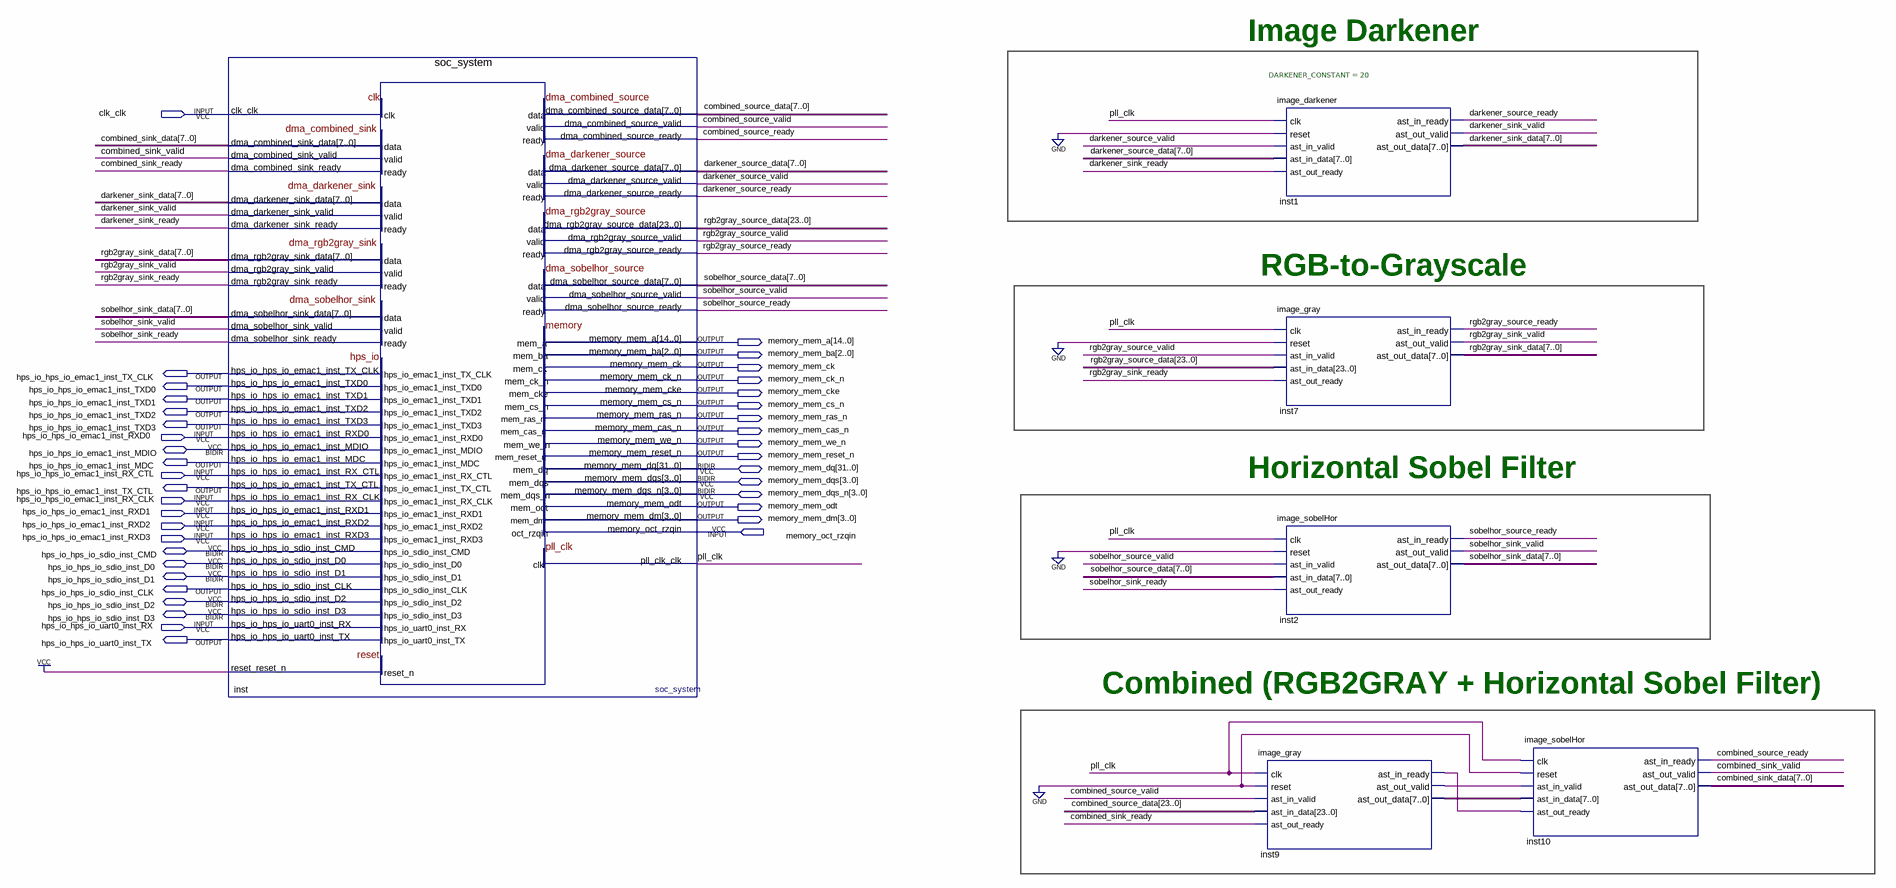
[diagram p0: schematic sheet]
// Quartus schematic main.bdf as structural Verilog: 6 symbols, 39 pins
module main (
  input  clk_clk,
  input  hps_io_hps_io_emac1_inst_RXD0,
  input  hps_io_hps_io_emac1_inst_RX_CTL,
  input  hps_io_hps_io_emac1_inst_RX_CLK,
  input  hps_io_hps_io_emac1_inst_RXD1,
  input  hps_io_hps_io_emac1_inst_RXD2,
  input  memory_oct_rzqin,
  input  hps_io_hps_io_emac1_inst_RXD3,
  input  hps_io_hps_io_uart0_inst_RX,
  inout  hps_io_hps_io_emac1_inst_MDIO,
  inout  [31:0] memory_mem_dq,
  inout  [3:0] memory_mem_dqs,
  inout  [3:0] memory_mem_dqs_n,
  inout  hps_io_hps_io_sdio_inst_CMD,
  inout  hps_io_hps_io_sdio_inst_D0,
  inout  hps_io_hps_io_sdio_inst_D1,
  inout  hps_io_hps_io_sdio_inst_D2,
  inout  hps_io_hps_io_sdio_inst_D3,
  output [14:0] memory_mem_a,
  output [2:0] memory_mem_ba,
  output memory_mem_ck,
  output hps_io_hps_io_emac1_inst_TX_CLK,
  output memory_mem_ck_n,
  output hps_io_hps_io_emac1_inst_TXD0,
  output memory_mem_cke,
  output hps_io_hps_io_emac1_inst_TXD1,
  output memory_mem_cs_n,
  output hps_io_hps_io_emac1_inst_TXD2,
  output memory_mem_ras_n,
  output hps_io_hps_io_emac1_inst_TXD3,
  output memory_mem_cas_n,
  output memory_mem_we_n,
  output memory_mem_reset_n,
  output hps_io_hps_io_emac1_inst_MDC,
  output hps_io_hps_io_emac1_inst_TX_CTL,
  output memory_mem_odt,
  output [3:0] memory_mem_dm,
  output hps_io_hps_io_sdio_inst_CLK,
  output hps_io_hps_io_uart0_inst_TX
);

  wire combined_sink_ready, combined_sink_valid, combined_source_ready, combined_source_valid,
       darkener_sink_ready, darkener_sink_valid, darkener_source_ready, darkener_source_valid,
       inst9_ast_in_ready, inst9_ast_out_valid, pll_clk, rgb2gray_sink_ready, rgb2gray_sink_valid,
       rgb2gray_source_ready, rgb2gray_source_valid, sobelhor_sink_ready, sobelhor_sink_valid,
       sobelhor_source_ready, sobelhor_source_valid;
  wire [7:0] combined_sink_data, darkener_sink_data, darkener_source_data, inst9_ast_out_data,
       rgb2gray_sink_data, sobelhor_sink_data, sobelhor_source_data;
  wire [23:0] combined_source_data, rgb2gray_source_data;

  soc_system inst (
    .clk_clk(clk_clk), .dma_combined_sink_data(combined_sink_data),
    .dma_combined_sink_valid(combined_sink_valid), .dma_combined_source_ready(combined_source_ready),
    .dma_darkener_sink_data(darkener_sink_data), .dma_darkener_sink_valid(darkener_sink_valid),
    .dma_darkener_source_ready(darkener_source_ready), .dma_rgb2gray_sink_data(rgb2gray_sink_data),
    .dma_rgb2gray_sink_valid(rgb2gray_sink_valid), .dma_rgb2gray_source_ready(rgb2gray_source_ready),
    .dma_sobelhor_sink_data(sobelhor_sink_data), .dma_sobelhor_sink_valid(sobelhor_sink_valid),
    .dma_sobelhor_source_ready(sobelhor_source_ready),
    .hps_io_hps_io_emac1_inst_RXD0(hps_io_hps_io_emac1_inst_RXD0),
    .hps_io_hps_io_emac1_inst_RX_CTL(hps_io_hps_io_emac1_inst_RX_CTL),
    .hps_io_hps_io_emac1_inst_RX_CLK(hps_io_hps_io_emac1_inst_RX_CLK),
    .hps_io_hps_io_emac1_inst_RXD1(hps_io_hps_io_emac1_inst_RXD1),
    .hps_io_hps_io_emac1_inst_RXD2(hps_io_hps_io_emac1_inst_RXD2),
    .hps_io_hps_io_emac1_inst_RXD3(hps_io_hps_io_emac1_inst_RXD3),
    .hps_io_hps_io_uart0_inst_RX(hps_io_hps_io_uart0_inst_RX), .memory_oct_rzqin(memory_oct_rzqin),
    .reset_reset_n(1'b1), .dma_combined_sink_ready(combined_sink_ready),
    .dma_combined_source_data(combined_source_data[7:0]), .dma_combined_source_valid(combined_source_valid),
    .dma_darkener_sink_ready(darkener_sink_ready), .dma_darkener_source_data(darkener_source_data),
    .dma_darkener_source_valid(darkener_source_valid), .dma_rgb2gray_sink_ready(rgb2gray_sink_ready),
    .dma_rgb2gray_source_data(rgb2gray_source_data), .dma_rgb2gray_source_valid(rgb2gray_source_valid),
    .dma_sobelhor_sink_ready(sobelhor_sink_ready), .dma_sobelhor_source_data(sobelhor_source_data),
    .dma_sobelhor_source_valid(sobelhor_source_valid),
    .hps_io_hps_io_emac1_inst_TX_CLK(hps_io_hps_io_emac1_inst_TX_CLK),
    .hps_io_hps_io_emac1_inst_TXD0(hps_io_hps_io_emac1_inst_TXD0),
    .hps_io_hps_io_emac1_inst_TXD1(hps_io_hps_io_emac1_inst_TXD1),
    .hps_io_hps_io_emac1_inst_TXD2(hps_io_hps_io_emac1_inst_TXD2),
    .hps_io_hps_io_emac1_inst_TXD3(hps_io_hps_io_emac1_inst_TXD3),
    .hps_io_hps_io_emac1_inst_MDC(hps_io_hps_io_emac1_inst_MDC),
    .hps_io_hps_io_emac1_inst_TX_CTL(hps_io_hps_io_emac1_inst_TX_CTL),
    .hps_io_hps_io_sdio_inst_CLK(hps_io_hps_io_sdio_inst_CLK),
    .hps_io_hps_io_uart0_inst_TX(hps_io_hps_io_uart0_inst_TX), .memory_mem_a(memory_mem_a),
    .memory_mem_ba(memory_mem_ba), .memory_mem_ck(memory_mem_ck), .memory_mem_ck_n(memory_mem_ck_n),
    .memory_mem_cke(memory_mem_cke), .memory_mem_cs_n(memory_mem_cs_n), .memory_mem_ras_n(memory_mem_ras_n),
    .memory_mem_cas_n(memory_mem_cas_n), .memory_mem_we_n(memory_mem_we_n),
    .memory_mem_reset_n(memory_mem_reset_n), .memory_mem_odt(memory_mem_odt), .memory_mem_dm(memory_mem_dm),
    .pll_clk_clk(pll_clk), .hps_io_hps_io_emac1_inst_MDIO(hps_io_hps_io_emac1_inst_MDIO),
    .hps_io_hps_io_sdio_inst_CMD(hps_io_hps_io_sdio_inst_CMD),
    .hps_io_hps_io_sdio_inst_D0(hps_io_hps_io_sdio_inst_D0),
    .hps_io_hps_io_sdio_inst_D1(hps_io_hps_io_sdio_inst_D1),
    .hps_io_hps_io_sdio_inst_D2(hps_io_hps_io_sdio_inst_D2),
    .hps_io_hps_io_sdio_inst_D3(hps_io_hps_io_sdio_inst_D3), .memory_mem_dq(memory_mem_dq),
    .memory_mem_dqs(memory_mem_dqs), .memory_mem_dqs_n(memory_mem_dqs_n));
  image_gray inst9 (
    .clk(pll_clk), .reset(1'b0), .ast_in_valid(combined_source_valid), .ast_in_data(combined_source_data),
    .ast_out_ready(combined_sink_ready), .ast_in_ready(inst9_ast_in_ready),
    .ast_out_valid(inst9_ast_out_valid), .ast_out_data(inst9_ast_out_data));
  image_darkener #(.DARKENER_CONSTANT(20)) inst1 (
    .clk(pll_clk), .reset(1'b0), .ast_in_valid(darkener_source_valid), .ast_in_data(darkener_source_data),
    .ast_out_ready(darkener_sink_ready), .ast_in_ready(darkener_source_ready),
    .ast_out_valid(darkener_sink_valid), .ast_out_data(darkener_sink_data));
  image_gray inst7 (
    .clk(pll_clk), .reset(1'b0), .ast_in_valid(rgb2gray_source_valid), .ast_in_data(rgb2gray_source_data),
    .ast_out_ready(rgb2gray_sink_ready), .ast_in_ready(rgb2gray_source_ready),
    .ast_out_valid(rgb2gray_sink_valid), .ast_out_data(rgb2gray_sink_data));
  image_sobelHor inst2 (
    .clk(pll_clk), .reset(1'b0), .ast_in_valid(sobelhor_source_valid), .ast_in_data(sobelhor_source_data),
    .ast_out_ready(sobelhor_sink_ready), .ast_in_ready(sobelhor_source_ready),
    .ast_out_valid(sobelhor_sink_valid), .ast_out_data(sobelhor_sink_data));
  image_sobelHor inst10 (
    .clk(pll_clk), .reset(1'b0), .ast_in_valid(inst9_ast_out_valid), .ast_in_data(inst9_ast_out_data),
    .ast_out_ready(inst9_ast_in_ready), .ast_in_ready(combined_source_ready),
    .ast_out_valid(combined_sink_valid), .ast_out_data(combined_sink_data));

  // Notes on the sheet:
  //   Image Darkener
  //   RGB-to-Grayscale
  //   Horizontal Sobel Filter
  //   Combined (RGB2GRAY + Horizontal Sobel Filter)
endmodule
